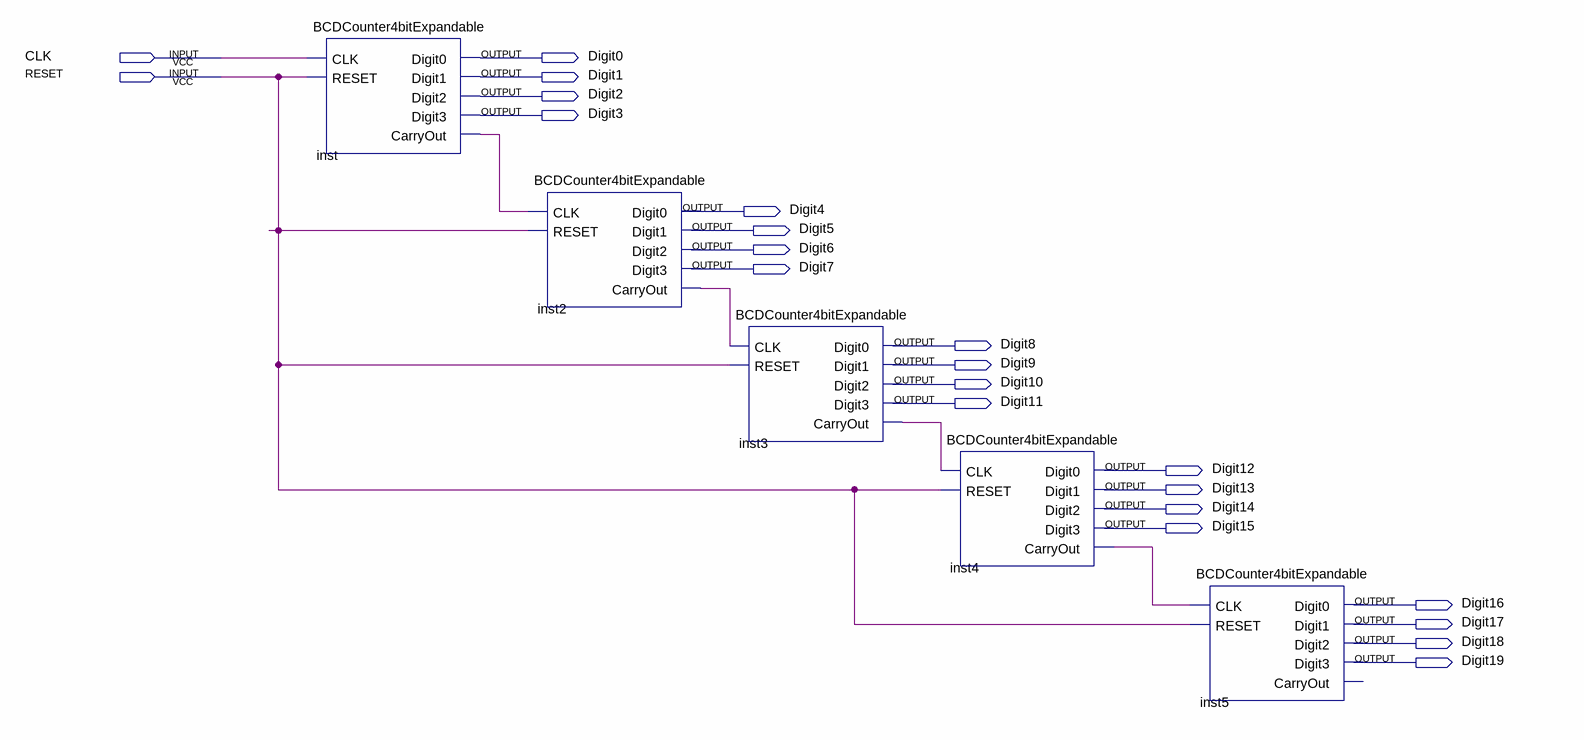
[diagram p0: schematic sheet]
// Quartus schematic BCDCounter16bit.bdf as structural Verilog: 5 symbols, 22 pins
module BCDCounter16bit (
  input  CLK,
  input  RESET,
  output Digit0,
  output Digit1,
  output Digit2,
  output Digit3,
  output Digit4,
  output Digit5,
  output Digit6,
  output Digit7,
  output Digit8,
  output Digit9,
  output Digit10,
  output Digit11,
  output Digit12,
  output Digit13,
  output Digit14,
  output Digit15,
  output Digit16,
  output Digit17,
  output Digit18,
  output Digit19
);

  wire inst2_carryout, inst3_carryout, inst4_carryout, inst_carryout;

  BCDCounter4bitExpandable inst (
    .CLK(CLK), .RESET(RESET), .Digit0(Digit0), .Digit1(Digit1), .Digit2(Digit2), .Digit3(Digit3),
    .CarryOut(inst_carryout));
  BCDCounter4bitExpandable inst2 (
    .CLK(inst_carryout), .RESET(RESET), .Digit0(Digit4), .Digit1(Digit5), .Digit2(Digit6), .Digit3(Digit7),
    .CarryOut(inst2_carryout));
  BCDCounter4bitExpandable inst3 (
    .CLK(inst2_carryout), .RESET(RESET), .Digit0(Digit8), .Digit1(Digit9), .Digit2(Digit10),
    .Digit3(Digit11), .CarryOut(inst3_carryout));
  BCDCounter4bitExpandable inst4 (
    .CLK(inst3_carryout), .RESET(RESET), .Digit0(Digit12), .Digit1(Digit13), .Digit2(Digit14),
    .Digit3(Digit15), .CarryOut(inst4_carryout));
  BCDCounter4bitExpandable inst5 (
    .CLK(inst4_carryout), .RESET(RESET), .Digit0(Digit16), .Digit1(Digit17), .Digit2(Digit18),
    .Digit3(Digit19));  // open: CarryOut
endmodule
